# Altium schematic sheet UI Board TOP.SchDoc
size A3
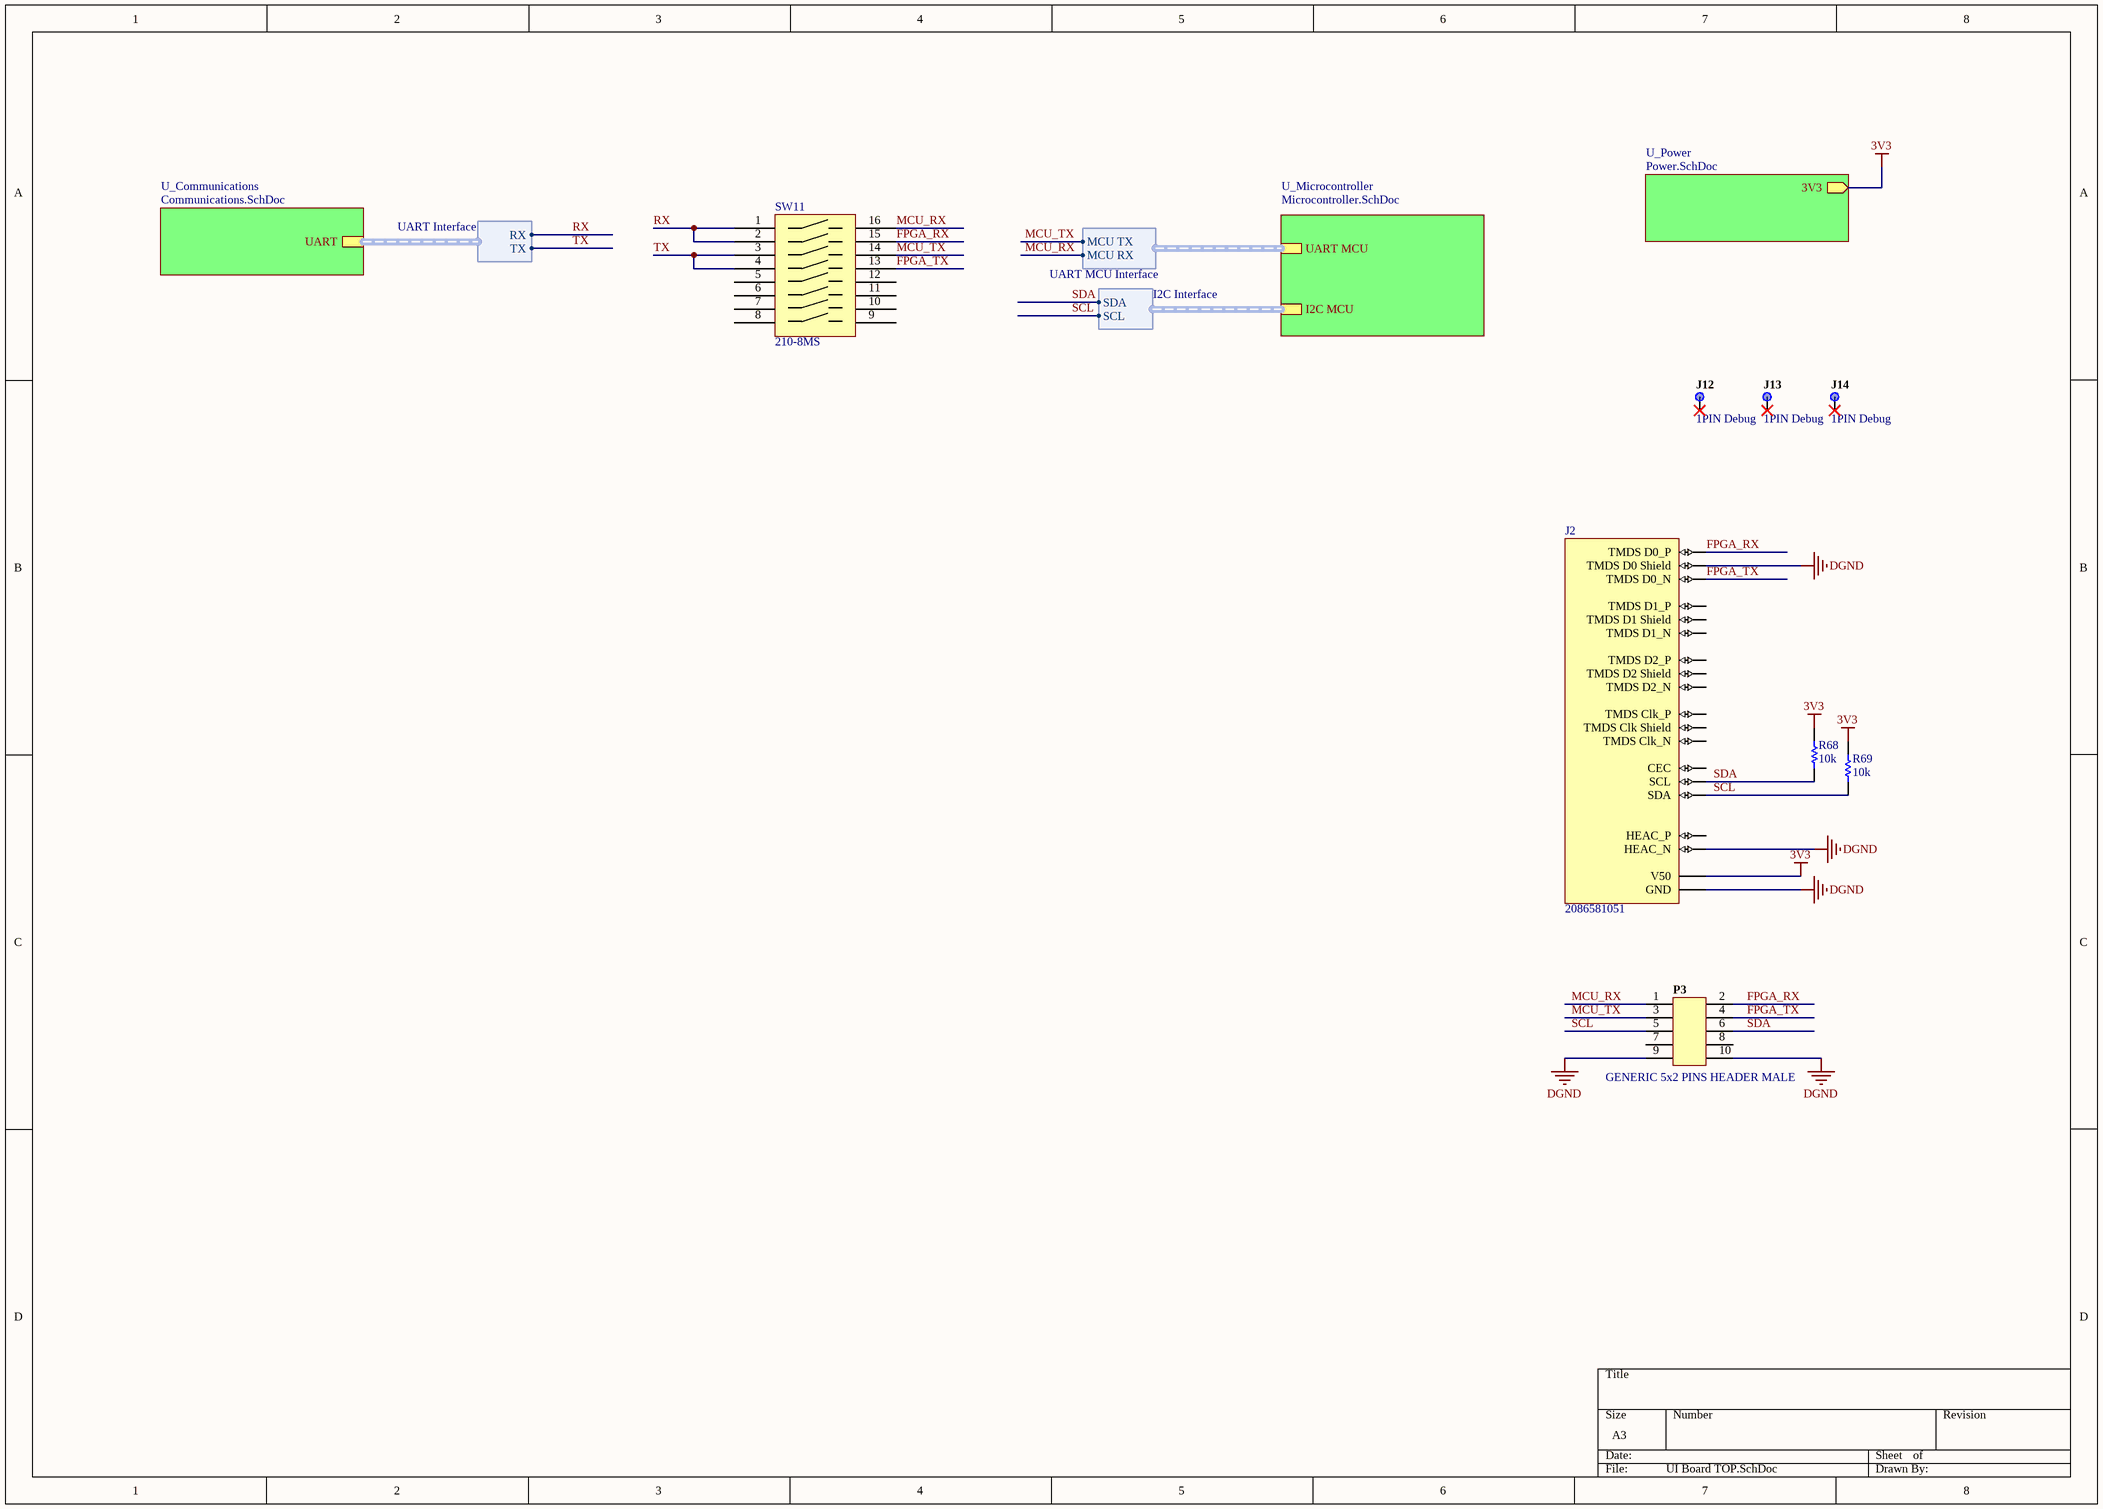
[diagram p0: UI Board TOP.SchDoc]

## Parts
J2  2086581051  [2086581051]
J12  1PIN Debug  [1 Pin Debug Port 0.9mm]
J13  1PIN Debug  [1 Pin Debug Port 0.9mm]
J14  1PIN Debug  [1 Pin Debug Port 0.9mm]
P3  GENERIC 5x2 PINS HEADER MALE  [GENERIC 5PIN 2ROW HEADER 0]
R68  value 10k  [0402-M]  (hidden comment: RES 10k 0402 63mW 5%)
R69  value 10k  [0402-M]  (hidden comment: RES 10k 0402 63mW 5%)
SW11  210-8MS  [210-8MS]

## Sub-sheets
U_Communications = Communications.SchDoc: UART (harness UART Interface)
U_Microcontroller = Microcontroller.SchDoc: UART MCU (harness UART MCU Interface), I2C MCU (harness I2C Interface)
U_Power = Power.SchDoc: 3V3 (out)

## Harnesses
UART Interface: RX, TX
UART MCU Interface: MCU RX, MCU TX
I2C Interface: SDA, SCL

## Nets
3V3: J2.18(V50) R68.2 R69.2 ; sheet U_Power/3V3
DGND: J2.8(TMDS_D0_Shield) J2.17(GND) J2.19(HEAC_N) P3.9 P3.10
FPGA_RX: J2.7(TMDS_D0_P) P3.2 SW11.15(SW2.in)
FPGA_TX: J2.9(TMDS_D0_N) P3.4 SW11.13(SW4.in)
MCU_RX: P3.1 SW11.16(SW1) ; sheet U_Microcontroller/UART MCU.MCU RX
MCU_TX: P3.3 SW11.14(SW3.in) ; sheet U_Microcontroller/UART MCU.MCU TX
RX: SW11.1(SW1) SW11.2(SW2) ; sheet U_Communications/UART.RX
SCL: J2.16(SDA) P3.5 R69.1 ; sheet U_Microcontroller/I2C MCU.SCL
SDA: J2.15(SCL) P3.6 R68.1 ; sheet U_Microcontroller/I2C MCU.SDA
TX: SW11.3(SW3) SW11.4(SW4) ; sheet U_Communications/UART.TX

Not connected (* = marked no-connect by the designer): J2 1(TMDS_D2_P) 2(TMDS_D2_Shield) 3(TMDS_D2_N) 4(TMDS_D1_P) 5(TMDS_D1_Shield) 6(TMDS_D1_N) 10(TMDS_Clk_P) 11(TMDS_Clk_Shield) 12(TMDS_Clk_N) 13(CEC) 14(HEAC_P); J12 1*; J13 1*; J14 1*; P3 7 8; SW11 5(SW1) 6(SW2) 7 8(SW4) 9(SW4.in) 10(SW3.in) 11(SW2.in) 12(SW1.in)

## Library data of the parts
J2 = 2086581051-2: CONN FEM SMD 19 90Deg HDMI; Manufacturer: Molex; Status: Active; Supplier 1: Mouser; Source: Connector Library.SchLib; Design Item ID: 2086581051; Bin: *; Supplier Part Number 1: Mouser; Type: HYBRID; Case/Package: 4 PIN
J12-J14 = 1PIN Debug-2: CONN MAL TH 1 0Deg HEADER; Status: NC; Case/Package: 1 PIN; Source: Connector Library.SchLib; Type: N/A; Design Item ID: 1PIN Debug
P3 = GENERIC 5x2 PINS HEADER MALE-2: CONN MAL TH 5x2 0Deg HEADER; Bin: B3-J5; Status: Active; Case/Package: 2 PIN; Source: Connector Library.SchLib; Type: TH; Design Item ID: GENERIC 5x2 PINS HEADER MALE; Manufacturer: Generic
R68 R69 = RES 10k 0402 63mW 5%-1: RES-10k-0402-63mW-5%; Manufacturer: Generic; Bin: F1-R7-9; MAPPING: 1(2,1,11.5k); Design Item ID: RES 10k 0402 63mW 5%; Type: SMD; Status: Active; Case/Package: 0402; Source: Resistor Library.SchLib
SW11 = 210-8MS-2: SWITCH DIP SMD SPST 8 100mA 50V; Manufacturer: C&K Components; Supplier Part Number 1: 774-2108MS; Design Item ID: 210-8MS; Source: Switches Library.SchLib; Case/Package: 16 PDIP; Supplier 1: Mouser; Status: Active; Type: TH